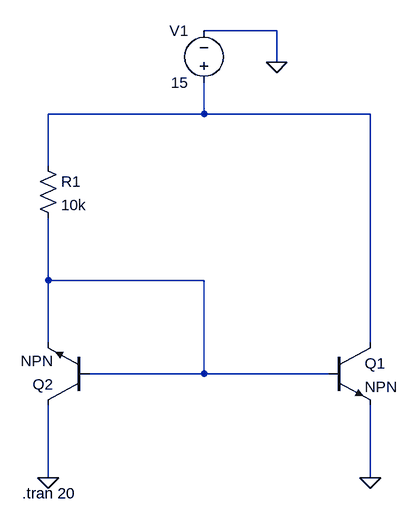
[diagram p0: schematic current_mirror_usibg_BJT.asc]
current_mirror_usibg_BJT.asc, the LTspice schematic file:
Version 4.1
SHEET 1 880 680
WIRE 192 -368 80 -368
WIRE 192 -320 192 -368
WIRE 80 -240 80 -288
WIRE 80 -240 -160 -240
WIRE 336 -240 80 -240
WIRE -160 -160 -160 -240
WIRE -160 16 -160 -80
WIRE 80 16 -160 16
WIRE -160 112 -160 16
WIRE 336 112 336 -240
WIRE 80 160 80 16
WIRE 80 160 -96 160
WIRE 272 160 80 160
WIRE -160 320 -160 208
WIRE 336 320 336 208
FLAG 192 -320 0
FLAG -160 320 0
FLAG 336 320 0
SYMBOL npn 272 112 R0
SYMATTR InstName Q1
SYMBOL npn -96 208 R180
SYMATTR InstName Q2
SYMBOL res -176 -176 R0
SYMATTR InstName R1
SYMATTR Value 10k
SYMBOL voltage 80 -272 R180
WINDOW 0 24 96 Left 2
WINDOW 3 24 16 Left 2
WINDOW 123 0 0 Left 0
WINDOW 39 0 0 Left 0
SYMATTR InstName V1
SYMATTR Value 15
TEXT -200 344 Left 2 !.tran 20

The netlist it stands for:
* current_mirror_usibg_BJT.asc
Q1 N001 N002 0 0 NPN
Q2 0 N002 N002 0 NPN
R1 N001 N002 10k
V1 N001 0 15
.model NPN NPN
.model PNP PNP
.lib standard.bjt
.tran 20
.backanno
.end